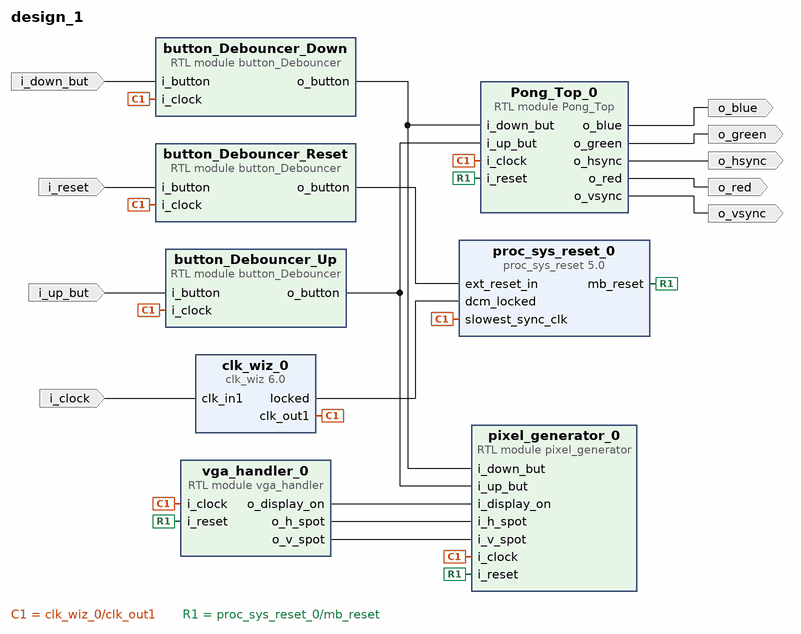
[diagram p0: block diagram of the top level]
# Vivado block design design_1, xc7a35tftg256-1, Vivado 2024.2
create_bd_design design_1

create_bd_port -dir O o_blue
create_bd_port -dir O o_green
create_bd_port -dir O o_red
create_bd_port -dir O o_vsync
create_bd_port -dir O o_hsync
create_bd_port -dir I i_down_but
create_bd_port -dir I i_up_but
create_bd_port -dir I i_reset
create_bd_port -dir I -type clk i_clock

create_bd_cell -type module -reference pixel_generator pixel_generator_0
create_bd_cell -type module -reference vga_handler vga_handler_0
create_bd_cell -type module -reference button_Debouncer button_Debouncer_Down
create_bd_cell -type module -reference button_Debouncer button_Debouncer_Up
create_bd_cell -type module -reference button_Debouncer button_Debouncer_Reset
create_bd_cell -type ip -vlnv xilinx.com:ip:clk_wiz:6.0 clk_wiz_0
set_property -dict {CONFIG.USE_LOCKED true CONFIG.USE_RESET false} [get_bd_cells clk_wiz_0]
create_bd_cell -type ip -vlnv xilinx.com:ip:proc_sys_reset:5.0 proc_sys_reset_0
create_bd_cell -type module -reference Pong_Top Pong_Top_0

# ---- connections ----

connect_bd_net [get_bd_pins Pong_Top_0/o_blue] [get_bd_ports o_blue]
connect_bd_net [get_bd_pins Pong_Top_0/o_green] [get_bd_ports o_green]
connect_bd_net [get_bd_pins Pong_Top_0/o_hsync] [get_bd_ports o_hsync]
connect_bd_net [get_bd_pins Pong_Top_0/o_red] [get_bd_ports o_red]
connect_bd_net [get_bd_pins Pong_Top_0/o_vsync] [get_bd_ports o_vsync]
connect_bd_net [get_bd_pins button_Debouncer_Down/o_button] [get_bd_pins pixel_generator_0/i_down_but] [get_bd_pins Pong_Top_0/i_down_but]
connect_bd_net [get_bd_pins button_Debouncer_Reset/o_button] [get_bd_pins proc_sys_reset_0/ext_reset_in]
connect_bd_net [get_bd_pins button_Debouncer_Up/o_button] [get_bd_pins pixel_generator_0/i_up_but] [get_bd_pins Pong_Top_0/i_up_but]
connect_bd_net -net clk_in1_0_1 [get_bd_ports i_clock] [get_bd_pins clk_wiz_0/clk_in1]
connect_bd_net [get_bd_pins clk_wiz_0/clk_out1] \
  [get_bd_pins proc_sys_reset_0/slowest_sync_clk] [get_bd_pins button_Debouncer_Up/i_clock] \
  [get_bd_pins button_Debouncer_Reset/i_clock] [get_bd_pins pixel_generator_0/i_clock] [get_bd_pins vga_handler_0/i_clock] \
  [get_bd_pins button_Debouncer_Down/i_clock] [get_bd_pins Pong_Top_0/i_clock]
connect_bd_net [get_bd_pins clk_wiz_0/locked] [get_bd_pins proc_sys_reset_0/dcm_locked]
connect_bd_net -net i_button_0_1 [get_bd_ports i_down_but] [get_bd_pins button_Debouncer_Down/i_button]
connect_bd_net -net i_button_1_1 [get_bd_ports i_up_but] [get_bd_pins button_Debouncer_Up/i_button]
connect_bd_net -net i_button_2_1 [get_bd_ports i_reset] [get_bd_pins button_Debouncer_Reset/i_button]
connect_bd_net [get_bd_pins proc_sys_reset_0/mb_reset] \
  [get_bd_pins pixel_generator_0/i_reset] [get_bd_pins vga_handler_0/i_reset] [get_bd_pins Pong_Top_0/i_reset]
connect_bd_net [get_bd_pins vga_handler_0/o_display_on] [get_bd_pins pixel_generator_0/i_display_on]
connect_bd_net [get_bd_pins vga_handler_0/o_h_spot] [get_bd_pins pixel_generator_0/i_h_spot]
connect_bd_net [get_bd_pins vga_handler_0/o_v_spot] [get_bd_pins pixel_generator_0/i_v_spot]

validate_bd_design
save_bd_design
